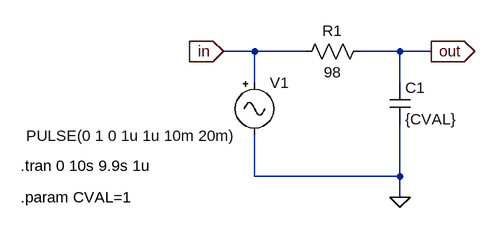
[diagram p0: schematic RC-low-pass-filter.asc]
RC-low-pass-filter.asc, the LTspice schematic file:
Version 4
SHEET 1 880 680
WIRE 32 64 -16 64
WIRE 112 64 32 64
WIRE 256 64 192 64
WIRE 304 64 256 64
WIRE 32 112 32 64
WIRE 256 112 256 64
WIRE 32 256 32 192
WIRE 256 256 256 176
WIRE 256 256 32 256
WIRE 256 288 256 256
FLAG 256 288 0
FLAG -16 64 in
IOPIN -16 64 In
FLAG 304 64 out
IOPIN 304 64 Out
SYMBOL Misc\\signal 32 96 R0
WINDOW 3 -352 98 Left 2
WINDOW 123 0 0 Left 0
WINDOW 39 0 0 Left 0
SYMATTR InstName V1
SYMATTR Value PULSE(0 1 0 1u 1u 10m 20m)
SYMBOL res 208 48 R90
WINDOW 0 0 56 VBottom 2
WINDOW 3 32 56 VTop 2
SYMATTR InstName R1
SYMATTR Value 98
SYMBOL cap 240 112 R0
SYMATTR InstName C1
SYMATTR Value {CVAL}
TEXT -328 240 Left 2 !.tran 0 10s 9.9s 1u
TEXT -328 288 Left 2 !.param CVAL=1

The netlist it stands for:
* RC-low-pass-filter.asc
V1 in 0 PULSE(0 1 0 1u 1u 10m 20m)
R1 out in 98
C1 out 0 {CVAL}
.tran 0 10s 9.9s 1u
.param CVAL=1
.backanno
.end